# EAGLE schematic backplane_v2 (EAGLE 7.6.0)
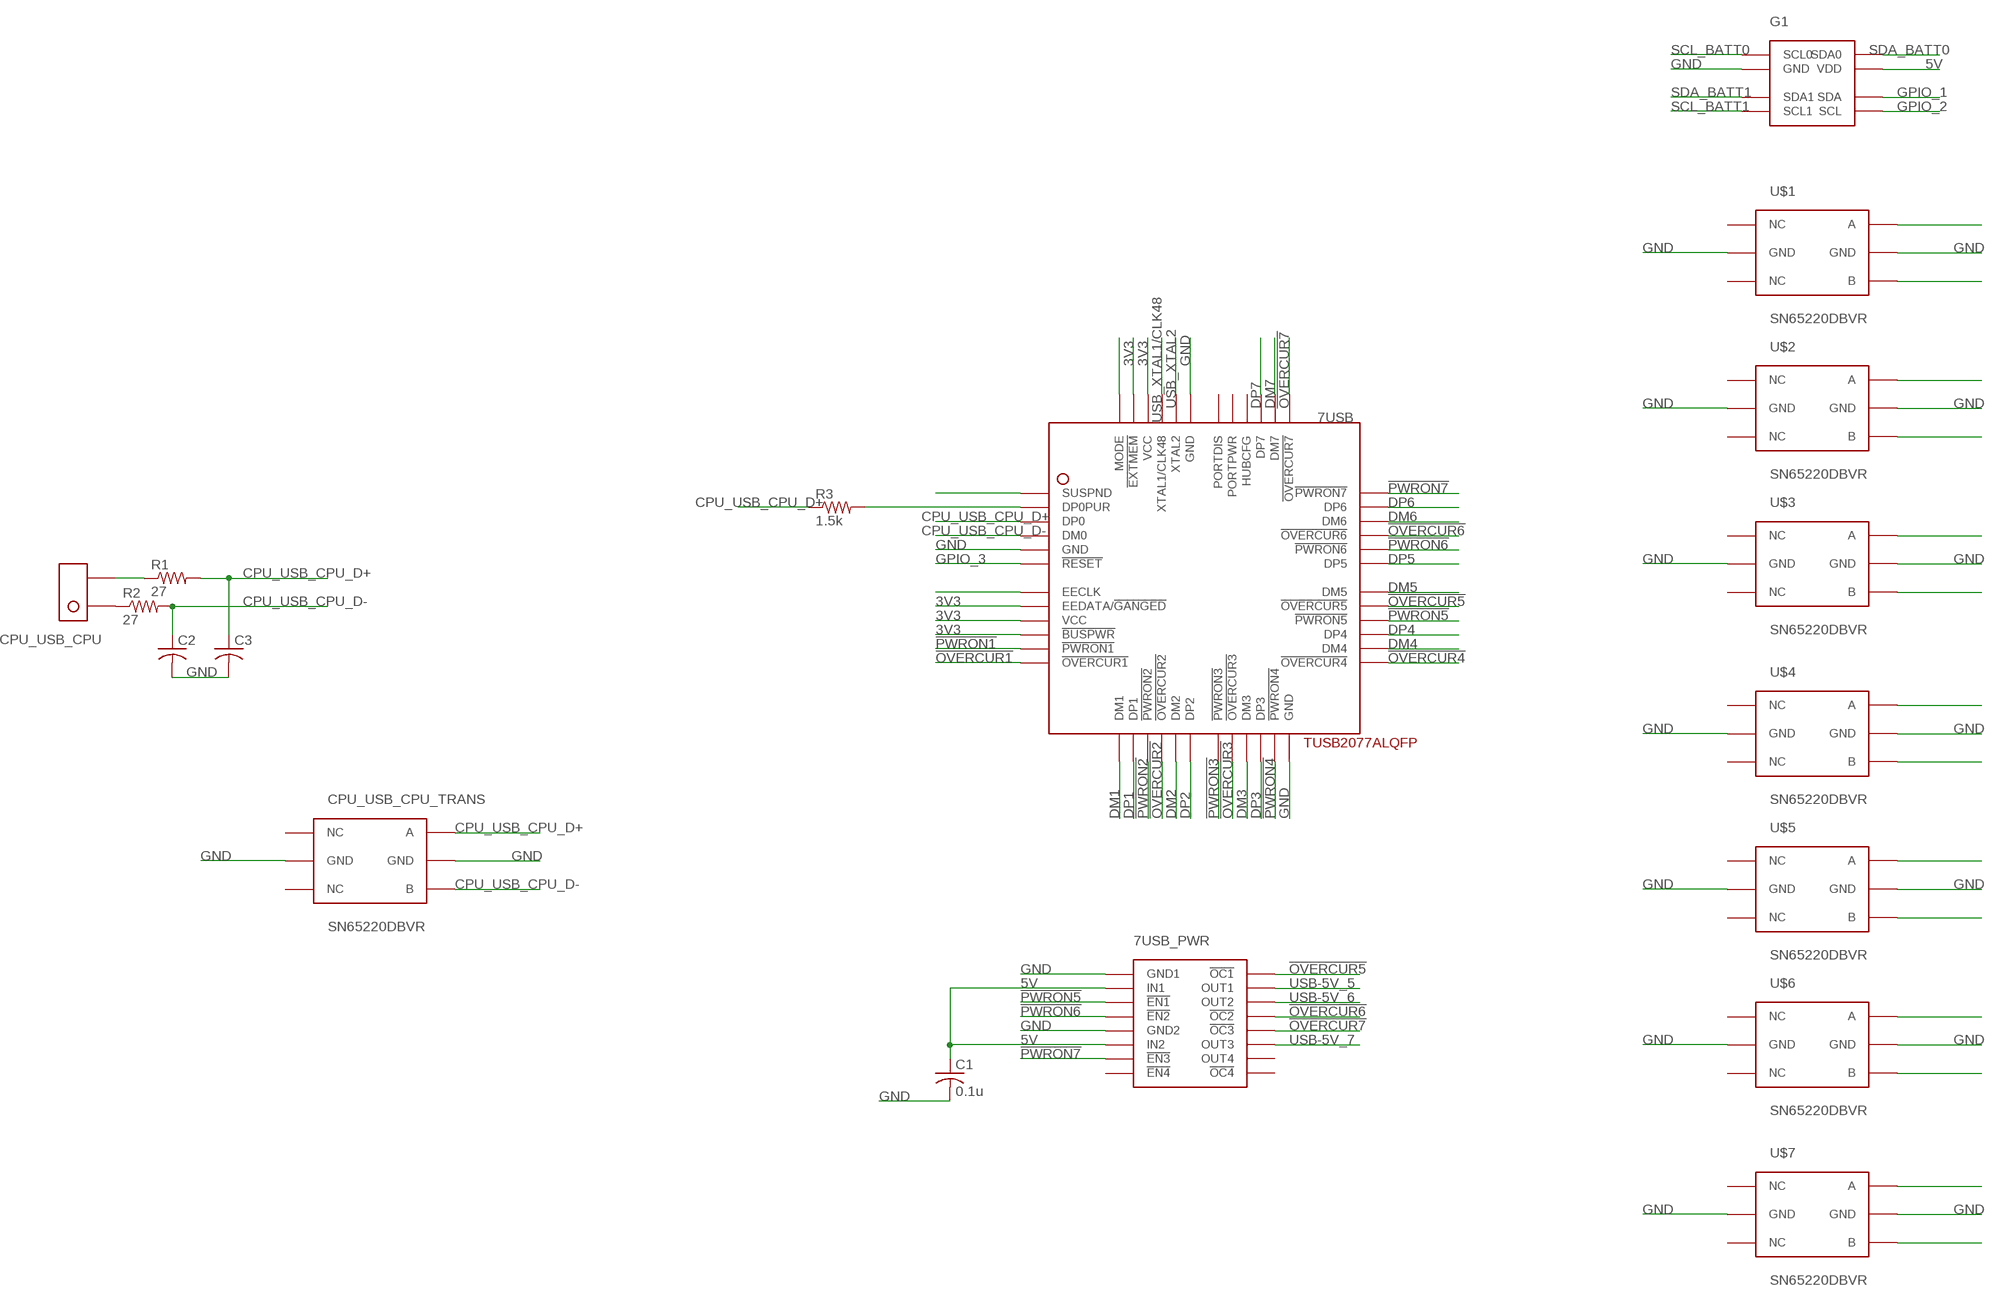
[diagram p0: schematic, sheet 1, part 1 of 2]
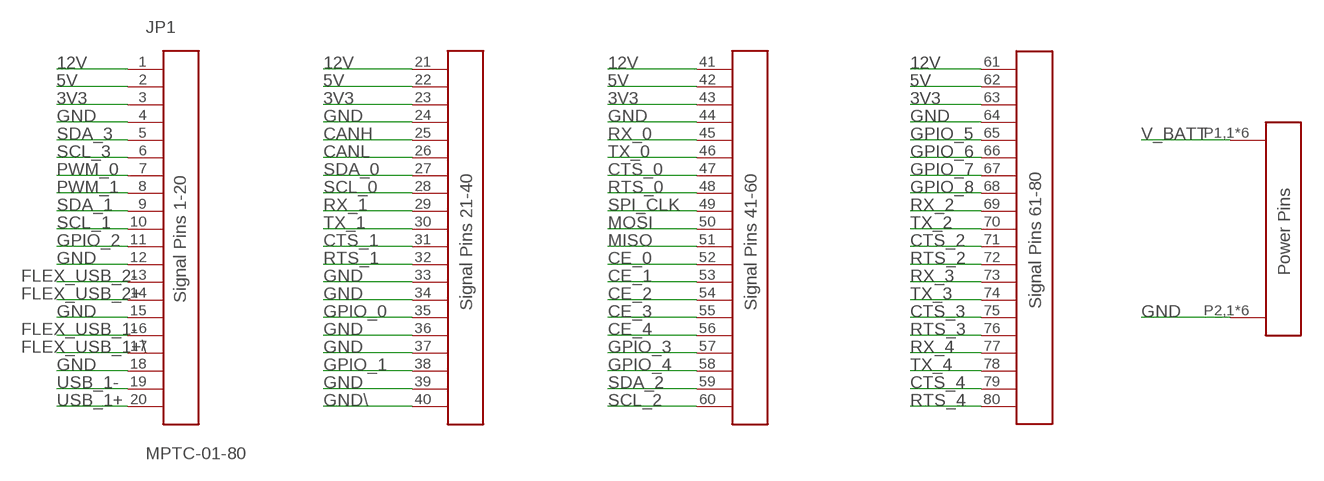
[diagram p1: schematic, sheet 1, part 2 of 2]

## Parts
7USB  TUSB2077ALQFP  [48-LQFP_0.5MM_PITCH]
7USB_PWR  TPS2044BBD-SOIC  [TPS2044]
C1  0.1u  C-USC0603  [C0603]
C2  C-USC0805  [C0805]
C3  C-USC0805  [C0805]
CPU_USB_CPU  KK254_VERT_2PIN22-29-2021  [KK254_VERT_2PIN]
CPU_USB_CPU_TRANS  SN65220DBVR  [SOT23-6PIN]
G1  PCA9540BTSSOP8  [PCA9540B]
JP1  MPTC-01-80  [MPTC-01-80]
R1  27  R-US_R0805  [R0805]
R2  27  R-US_R0805  [R0805]
R3  1.5k  R-US_R0805  [R0805]
U$1  SN65220DBVR  [SOT23-6PIN]
U$2  SN65220DBVR  [SOT23-6PIN]
U$3  SN65220DBVR  [SOT23-6PIN]
U$4  SN65220DBVR  [SOT23-6PIN]
U$5  SN65220DBVR  [SOT23-6PIN]
U$6  SN65220DBVR  [SOT23-6PIN]
U$7  SN65220DBVR  [SOT23-6PIN]

## Nets
3V3: 7USB.P$8(EEDATA/!GANGED!) 7USB.P$9(VCC) 7USB.P$10(!BUSPWR!) 7USB.P$46(VCC) 7USB.P$47(!EXTMEM!) JP1.3 JP1.23 JP1.43 JP1.63
5V: 7USB_PWR.IN1 7USB_PWR.IN2 C1.1 G1.VDD JP1.2 JP1.22 JP1.42 JP1.62
12V: JP1.1 JP1.21 JP1.41 JP1.61
!OVERCUR1!: 7USB.P$12(!OVERCUR1!)
!OVERCUR2!: 7USB.P$16(!OVERCUR2!)
!OVERCUR3!: 7USB.P$20(!OVERCUR3!)
!OVERCUR4!: 7USB.P$25(!OVERCUR4!)
!OVERCUR5!: 7USB.P$29(!OVERCUR5!) 7USB_PWR.!OC1!
!OVERCUR6!: 7USB.P$33(!OVERCUR6!) 7USB_PWR.!OC2!
!OVERCUR7!: 7USB.P$37(!OVERCUR7!) 7USB_PWR.!OC3!
!PWRON1!: 7USB.P$11(!PWRON1!)
!PWRON2!: 7USB.P$15(!PWRON2!)
!PWRON3!: 7USB.P$19(!PWRON3!)
!PWRON4!: 7USB.P$23(!PWRON4!)
!PWRON5!: 7USB.P$28(!PWRON5!) 7USB_PWR.!EN1!
!PWRON6!: 7USB.P$32(!PWRON6!) 7USB_PWR.!EN2!
!PWRON7!: 7USB.P$36(!PWRON7!) 7USB_PWR.!EN3!
CANH: JP1.25
CANL: JP1.26
CE_0: JP1.52
CE_1: JP1.53
CE_2: JP1.54
CE_3: JP1.55
CE_4: JP1.56
CPU_USB_CPU_D+: 7USB.P$3(DP0) C3.1 CPU_USB_CPU_TRANS.P$6(A) R1.2 R3.1
CPU_USB_CPU_D-: 7USB.P$4(DM0) C2.1 CPU_USB_CPU_TRANS.P$4(B) R2.2
CTS_0: JP1.47
CTS_1: JP1.31
CTS_2: JP1.71
CTS_3: JP1.75
CTS_4: JP1.79
DM1: 7USB.P$13(DM1)
DM2: 7USB.P$17(DM2)
DM3: 7USB.P$21(DM3)
DM4: 7USB.P$26(DM4)
DM5: 7USB.P$30(DM5)
DM6: 7USB.P$34(DM6)
DM7: 7USB.P$38(DM7)
DP1: 7USB.P$14(DP1)
DP2: 7USB.P$18(DP2)
DP3: 7USB.P$22(DP3)
DP4: 7USB.P$27(DP4)
DP5: 7USB.P$31(DP5)
DP6: 7USB.P$35(DP6)
DP7: 7USB.P$39(DP7)
FLEX_USB_1+\: JP1.17
FLEX_USB_1-: JP1.16
FLEX_USB_2+: JP1.14
FLEX_USB_2-: JP1.13
GND: 7USB.P$5(GND) 7USB.P$24(GND) 7USB.P$43(GND) 7USB.P$48(MODE) 7USB_PWR.GND1 7USB_PWR.GND2 C1.2 C2.2 C3.2 CPU_USB_CPU_TRANS.P$2(GND) CPU_USB_CPU_TRANS.P$5(GND) G1.GND JP1.4 JP1.12 JP1.15 JP1.18 JP1.24 JP1.33 JP1.34 JP1.36 JP1.37 JP1.39 JP1.44 JP1.64 JP1.P2,1(POWER2) JP1.P2,2(POWER2) JP1.P2,3(POWER2) JP1.P2,4(POWER2) JP1.P2,5(POWER2) JP1.P2,6(POWER2) U$1.P$2(GND) U$1.P$5(GND) U$2.P$2(GND) U$2.P$5(GND) U$3.P$2(GND) U$3.P$5(GND) U$4.P$2(GND) U$4.P$5(GND) U$5.P$2(GND) U$5.P$5(GND) U$6.P$2(GND) U$6.P$5(GND) U$7.P$2(GND) U$7.P$5(GND)
GND\: JP1.40
GPIO_0: JP1.35
GPIO_1: G1.SDA JP1.38
GPIO_2: G1.SCL JP1.11
GPIO_3: 7USB.P$6(!RESET!) JP1.57
GPIO_4: JP1.58
GPIO_5: JP1.65
GPIO_6: JP1.66
GPIO_7: JP1.67
GPIO_8: JP1.68
MISO: JP1.51
MOSI: JP1.50
N$1: 7USB.P$1(SUSPND)
N$2: 7USB.P$2(DP0PUR) R3.2
N$5: CPU_USB_CPU.P$2 R1.1
N$6: U$2.P$6(A)
N$7: 7USB.P$7(EECLK)
N$8: U$2.P$4(B)
N$9: U$1.P$6(A)
N$10: U$1.P$4(B)
N$11: U$3.P$6(A)
N$12: U$3.P$4(B)
N$13: U$4.P$6(A)
N$14: U$4.P$4(B)
N$15: U$5.P$6(A)
N$16: U$5.P$4(B)
N$17: U$6.P$6(A)
N$18: U$6.P$4(B)
N$19: CPU_USB_CPU.P$1 R2.1
N$20: U$7.P$6(A)
N$21: U$7.P$4(B)
PWM_0: JP1.7
PWM_1: JP1.8
RTS_0: JP1.48
RTS_1: JP1.32
RTS_2: JP1.72
RTS_3: JP1.76
RTS_4: JP1.80
RX_0: JP1.45
RX_1: JP1.29
RX_2: JP1.69
RX_3: JP1.73
RX_4: JP1.77
SCL_0: JP1.28
SCL_1: JP1.10
SCL_2: JP1.60
SCL_3: JP1.6
SCL_BATT0: G1.SCL0
SCL_BATT1: G1.SCL1
SDA_0: JP1.27
SDA_1: JP1.9
SDA_2: JP1.59
SDA_3: JP1.5
SDA_BATT0: G1.SDA0
SDA_BATT1: G1.SDA1
SPI_CLK: JP1.49
TX_0: JP1.46
TX_1: JP1.30
TX_2: JP1.70
TX_3: JP1.74
TX_4: JP1.78
USB-5V_5: 7USB_PWR.OUT1
USB-5V_6: 7USB_PWR.OUT2
USB-5V_7: 7USB_PWR.OUT3
USB_1+: JP1.20
USB_1-: JP1.19
USB_XTAL1/CLK48: 7USB.P$45(XTAL1/CLK48)
USB_XTAL2: 7USB.P$44(XTAL2)
V_BATT: JP1.P1,1(POWER1) JP1.P1,2(POWER1) JP1.P1,3(POWER1) JP1.P1,4(POWER1) JP1.P1,5(POWER1) JP1.P1,6(POWER1)
Unconnected: 7USB.P$40(HUBCFG) 7USB.P$41(PORTPWR) 7USB.P$42(PORTDIS) 7USB_PWR.!EN4! 7USB_PWR.!OC4! 7USB_PWR.OUT4 CPU_USB_CPU_TRANS.P$1(NC) CPU_USB_CPU_TRANS.P$3(NC) U$1.P$1(NC) U$1.P$3(NC) U$2.P$1(NC) U$2.P$3(NC) U$3.P$1(NC) U$3.P$3(NC) U$4.P$1(NC) U$4.P$3(NC) U$5.P$1(NC) U$5.P$3(NC) U$6.P$1(NC) U$6.P$3(NC) U$7.P$1(NC) U$7.P$3(NC)

## Library data of the parts
7USB = texas:TUSB2077A: The Texas Instruments TUSB2007A in the 48-pin LQFP package. 7-port USB 2.0 hub/controller. Datasheet <http://www.ti.com/lit/ds/symlink/tusb2077a.pdf> Created by Ben Hurwitz, 10-6-16 Robotics@Maryland
7USB_PWR = texas:TPS2044B: Texas Instruments TPS2044BD-SOIC Current-limited power distribution switches 0.5A continuous current, 1.25A max current, 3.3-5V Datasheet <http://www.ti.com/lit/ds/symlink/tps2044b.pdf> NOTE: These replace the older TPS2044/54 switches.
C1-C3 = resistor:C-US: CAPACITOR, American symbol
CPU_USB_CPU = molex:KK254_VERT_2PIN: KK® 254 Wire-to-Board Header, Vertical, with Friction Lock, 2 Circuits, Gold (Au) Plating Part Number: 22-29-2021 http://www.molex.com/molex/products/datasheet.jsp?part=active/0022292021_PCB_HEADERS.xml
CPU_USB_CPU_TRANS U$1-U$7 = texas:SN65220DBVR: Texas Instruments SN65220 Dual Line USB Port Transient Suppressor Datasheet <http://www.ti.com/lit/ds/symlink/sn65220.pdf>
G1 = NXP:PCA9540B: NXP PCA9540B-TSSOP8 2-Channel I2C-bus Multiplexer I2C-controlled, 5V supply, 1.8-6.5V outputs, 20mA currents Datasheet <http://www.nxp.com/documents/data_sheet/PCA9540B.pdf> Created by Ben Hurwitz, 9 March 2016
JP1 = samtec:MPTC-01-80: Samtec 30A Signal/Power Combo System Part number: MPTC-01-80-01 Datasheet <http://suddendocs.samtec.com/catalog_english/mptc.pdf>, Drawing <http://suddendocs.samtec.com/prints/mptc-xx-xx-xx-6.30-xx-x-v-xx-mkt.pdf>, Footprint <http://suddendocs.samtec.com/prints/mptc-xx-xx-xx-6.30-xx-x-v-xx-footprint.pdf> Created by: Ben Hurwitz Created on: 3 Dec 2015 Project: Backplane Group: Robotics @ Maryland Autonomous Submarine University of Maryland, College Park, MD, USA Description; This is an 82-pin female signal/power combination plug, with 80 5A signal pins and 2 24.7A power blades (each uses six pins). It was designed to be used on a backplane for the autonomous submarine to connect the four main daughterboards to the CPU and batteries via the backplane. It fits with the Samtec MPSC male half.
R1-R3 = resistor:R-US_: RESISTOR, American symbol